# Altium project Net.PrjPcb
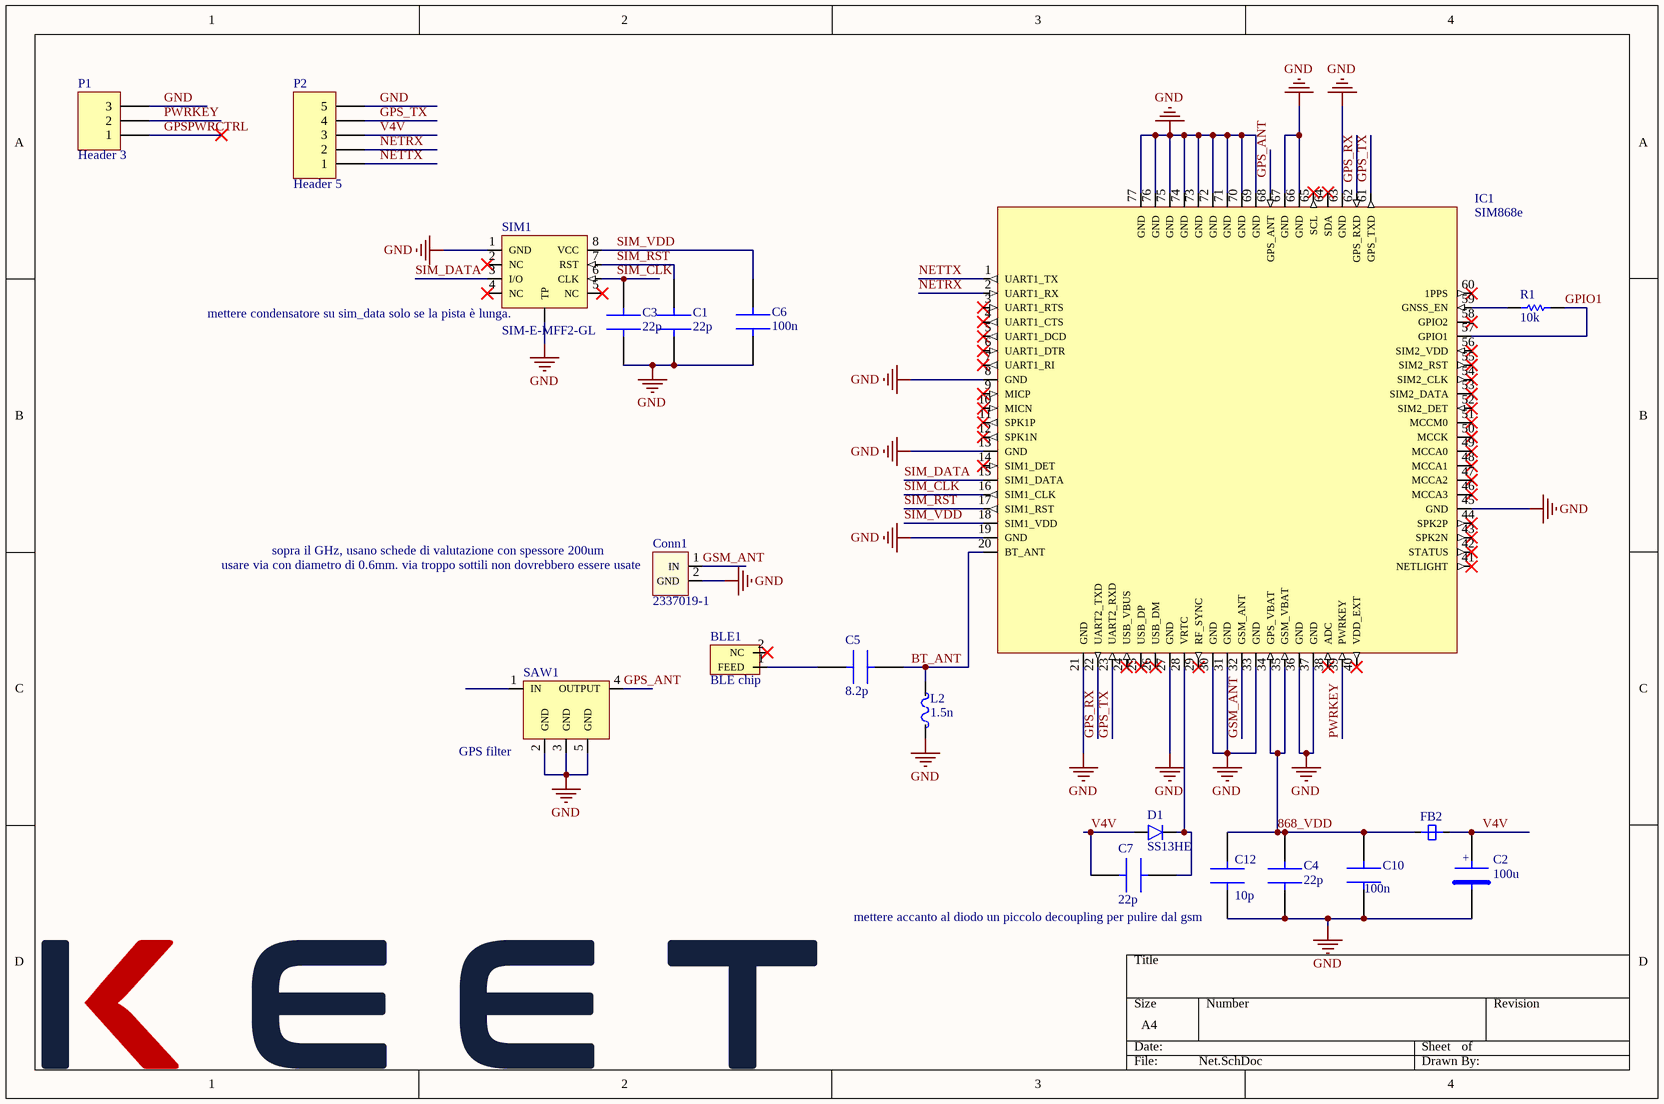
[diagram p0: Net.SchDoc]
1 sheet, 20 parts. Net scope: global (net labels, ports and power ports of the same name join across sheets).
Board file: Net.PcbDoc

## Sheet Net.SchDoc
size A4

### Parts
BLE1  BLE chip  [BLE antenna]
C1  22p  [CAPC1005X06N]
C2  100u  [CAPMP3528X21N]
C3  22p  [CAPC1005X06N]
C4  22p  [CAPC1005X06N]
C5  8.2p  [CAPC1005X06N]
C6  100n  [CAPC1005X06N]
C7  22p  [CAPC1005X06N]
C10  100n  [CAPC1005X06N]
C12  10p  [CAPC1005X06N]
Conn1  2337019-1  [IPEX_CONNECTOR_RF]
D1  SS13HE  [SODFL250X75-2N]
FB2  FBMH2012HM221-T  [INDC2012X14N]  (value not drawn)
IC1  SIM868e  [SIM868e]
L2  1.5n  [INDC1005X06N]
P1  Header 3  [HDR1X3]
P2  Header 5  [HDR1X5]
R1  10k  [RESC1005X04N]
SAW1  GPS filter  [SAW]
SIM1  SIM-E-MFF2-GL  [MFF2 SIM]

### Nets
GND: C1.1 C2.2 C3.1 C4.1 C6.2 C10.2 C12.1 Conn1.2(GND) IC1.8(GND) IC1.13(GND) IC1.19(GND) IC1.21(GND) IC1.27(GND) IC1.30(GND) IC1.31(GND) IC1.33(GND) IC1.36(GND) IC1.37(GND) IC1.45(GND) IC1.63(GND) IC1.66(GND) IC1.67(GND) IC1.69(GND) IC1.70(GND) IC1.71(GND) IC1.72(GND) IC1.73(GND) IC1.74(GND) IC1.75(GND) IC1.76(GND) IC1.77(GND) L2.1 P1.3 P2.5 SAW1.2(GND) SAW1.3(GND) SAW1.5(GND) SIM1.1(GND) SIM1.9(TP)
868_VDD: C4.2 C10.1 C12.2 FB2.1 IC1.34(GPS_VBAT) IC1.35(GSM_VBAT)
BT_ANT: C5.2 IC1.20(BT_ANT) L2.2
GPIO1: IC1.57(GPIO1) R1.2
GPS_ANT: IC1.68(GPS_ANT) SAW1.4(OUTPUT)
GPS_RX: IC1.22(UART2_TXD) IC1.62(GPS_RXD)
GPS_TX: IC1.23(UART2_RXD) IC1.61(GPS_TXD) P2.4
GPSPWRCTRL: P1.1
GSM_ANT: Conn1.1(IN) IC1.32(GSM_ANT)
NETRX: IC1.2(UART1_RX) P2.2
NETTX: IC1.1(UART1_TX) P2.1
PWRKEY: IC1.39(PWRKEY) P1.2
SIM_CLK: C3.2 IC1.16(SIM1_CLK) SIM1.6(CLK)
SIM_DATA: IC1.15(SIM1_DATA) SIM1.3(I/O)
SIM_RST: C1.2 IC1.17(SIM1_RST) SIM1.7(RST)
SIM_VDD: C6.1 IC1.18(SIM1_VDD) SIM1.8(VCC)
V4V: C2.1 C7.1 D1.1(A) FB2.2 P2.3
NetBLE1_1: BLE1.1(FEED) C5.1
NetC7_2: C7.2 D1.2(K) IC1.28(VRTC)
NetIC1_59: IC1.59(GNSS_EN) R1.1

Not connected (* = marked no-connect by the designer): BLE1 2(NC)*; IC1 3(UART1_RTS)* 4(UART1_CTS)* 5(UART1_DCD)* 6(UART1_DTR)* 7(UART1_RI)* 9(MICP)* 10(MICN)* 11(SPK1P)* 12(SPK1N)* 14(SIM1_DET)* 24(USB_VBUS)* 25(USB_DP)* 26(USB_DM)* 29(RF_SYNC)* 38(ADC)* 40(VDD_EXT)* 41(NETLIGHT)* 42(STATUS)* 43(SPK2N)* 44(SPK2P)* 46(MCCA3)* 47(MCCA2)* 48(MCCA1)* 49(MCCA0)* 50(MCCK)* 51(MCCM0)* 52(SIM2_DET)* 53(SIM2_DATA)* 54(SIM2_CLK)* 55(SIM2_RST)* 56(SIM2_VDD)* 58(GPIO2)* 60(1PPS)* 64(SDA)* 65(SCL)*; SAW1 1(IN); SIM1 2(NC)* 4(NC)* 5(NC)*

### Notes on the sheet
- (near SIM1) mettere condensatore su sim_data solo se la pista è lunga.
- (near Conn1) sopra il GHz, usano schede di valutazione con spessore 200um
- (near Conn1) usare via con diametro di 0.6mm. via troppo sottili non dovrebbero essere usate
- mettere accanto al diodo un piccolo decoupling per pulire dal gsm
- (in symbol TPSB107K006R0250) +

### Library data of the parts
BLE1 = 2450AT14A0100T: RF ANT 2.4GHZ CHIP SOLDER SMD; Manufacturer: Johanson; Number of Bands: 1; Return Loss: 9dB; Max Power Dissipation: 2W; Supplier 1: Digi-Key; Manufacturer Part Number: 2450AT14A0100T; RoHS: No; Stock 1: 5238; Pricing 1: 1=0,42000, 10=0,35600, 25=0,33240, 100=0,26600, 250=0,24700, 500=0,20900, 1000=0,16150 (USD); Mount: Surface Mount; Packaging: Tape and Reel; Termination: Solder; ComponentLink1URL: https://www.johansontechnology.com/datasheets/2450AT14A0100/2450AT14A0100.pdf?src-supplier=Digi-Key; ComponentLink1Description: https://www.johansontechnology.com/datasheets/2450AT14A0100/2450AT14A0100.pdf?src-supplier=Digi-Key; Supplier Part Number 1: 712-1636-1-ND
C1 C3 C4 C7 = 04025A220GAT2A: CAP CER 22PF 50V C0G/NP0 0402; Manufacturer: Kyocera AVX; Dielectric: C0G; Tolerance: 2%; Supplier 1: Digi-Key; Manufacturer Part Number: 04025A220GAT2A; RoHS: Yes; Category: Ceramic Capacitors; Stock 1: 14713; Pricing 1: 1=0,50000, 10=0,35200, 50=0,26600, 100=0,23170, 500=0,17160, 1000=0,14586, 2500=0,13728, 5000=0,12870 (USD); Mount: Surface Mount; Case/Package: 0402; Case Code (Metric): 1005; Case Code (Imperial): 0402; Min Operating Temperature: -55°C; Max Operating Temperature: 125°C; Packaging: Tape and Reel; Capacitance: 22pF; Package Quantity: 1; Voltage Rating (DC): 50V; Termination: SMD/SMT; Voltage Rating: 50V; Series: -; Construction: Flat; Length: 1mm; Width: 0.02inch; Height: 0.63mm; Depth: 0.5mm; Thickness: 0.022inch; Radiation Hardening: No; RoHS Compliant: Yes; Lead Free: Lead Free; ComponentLink1URL: https://datasheet.ciiva.com/7614/ccog-7614677.pdf?src-supplier=Digi-Key; ComponentLink1Description: https://datasheet.ciiva.com/7614/ccog-7614677.pdf?src-supplier=Digi-Key; ComponentLink2URL: https://datasheet.ciiva.com/17490/ccog-17490486.pdf?src-supplier=Avnet+Europe; ComponentLink2Description: https://datasheet.ciiva.com/17490/ccog-17490486.pdf?src-supplier=Avnet+Europe; ComponentLink3URL: https://datasheet.ciiva.com/5413/ccog-243403-5413992.pdf?src-supplier=Mouser; ComponentLink3Description: https://datasheet.ciiva.com/5413/ccog-243403-5413992.pdf?src-supplier=Mouser; ComponentLink4URL: https://datasheet.ciiva.com/210/ccog-210553.pdf?src-supplier=Digi-Key; ComponentLink4Description: https://datasheet.ciiva.com/210/ccog-210553.pdf?src-supplier=Digi-Key; ComponentLink5URL: https://datasheet.ciiva.com/11530/ccog-11530027.pdf?src-supplier=Avnet; ComponentLink5Description: https://datasheet.ciiva.com/11530/ccog-11530027.pdf?src-supplier=Avnet; ComponentLink6URL: https://datasheet.ciiva.com/14886/ccog-14886974.pdf?src-supplier=Digi-Key; ComponentLink6Description: https://datasheet.ciiva.com/14886/ccog-14886974.pdf?src-supplier=Digi-Key; Supplier Part Number 1: 478-7874-1-ND
C2 = TPSB107K006R0250: Capacitor; Tantalum; Cap 100 uF; Tol 10%; Vol-Rtg 6.3 VDC; SMT; 3528; ESR 250 mOhms; CT; Manufacturer: Kyocera AVX; Capacitance: 100uF; ESR (Equivalent Series Resistance): 250mR; Voltage Rating: 6.3V; Leakage Current: 6.3uA; Polarity: Polar; Supplier 1: Digi-Key; Manufacturer Part Number: TPSB107K006R0250; RoHS: Yes; Category: Tantalum Capacitors; Pricing 1: 1=0,51000, 10=0,36100, 50=0,27280, 100=0,23760, 500=0,17600, 1000=0,14960 (USD); Mount: Surface Mount,PCB; Case/Package: 1210; Number of Pins: 2; Case Code (Metric): 3528; Case Code (Imperial): 1210; Weight: 0.000564oz; Dielectric Material: Tantalum; Min Operating Temperature: -55°C; Max Operating Temperature: 125°C; Tolerance: 10%; Packaging: Tape and Reel; Package Quantity: 1; Voltage Rating (DC): 6.3V; Termination: SMD/SMT; Voltage: 6.3V; Dissipation Factor: 10%; Features: General Purpose; Series: TPS; Construction: Flat; Length: 3.5mm; Width: 0.11inch; Height: 1.9mm; Depth: 2.8mm; Height - Seated (Max): 0.083inch; Lead Pitch: 1.4mm; Radiation Hardening: No; REACH SVHC: No SVHC; Lead Free: Lead Free; RoHS Compliant: Yes; ComponentLink1URL: https://datasheet.ciiva.com/264/tps-264099.pdf?src-supplier=Digi-Key; ComponentLink1Description: https://datasheet.ciiva.com/264/tps-264099.pdf?src-supplier=Digi-Key; ComponentLink2URL: https://datasheet.ciiva.com/16501/tps-16501596.pdf?src-supplier=Future+Electronics; ComponentLink2Description: https://datasheet.ciiva.com/16501/tps-16501596.pdf?src-supplier=Future+Electronics; ComponentLink3URL: https://datasheet.ciiva.com/14603/70001047-14603743.pdf?src-supplier=Allied+Electronics; ComponentLink3Description: https://datasheet.ciiva.com/14603/70001047-14603743.pdf?src-supplier=Allied+Electronics; ComponentLink4URL: https://datasheet.ciiva.com/264/tps-264097.pdf?src-supplier=Digi-Key; ComponentLink4Description: https://datasheet.ciiva.com/264/tps-264097.pdf?src-supplier=Digi-Key; ComponentLink5URL: https://datasheet.ciiva.com/264/tps-264098.pdf?src-supplier=Digi-Key; ComponentLink5Description: https://datasheet.ciiva.com/264/tps-264098.pdf?src-supplier=Digi-Key; ComponentLink6URL: https://datasheet.ciiva.com/3004/tps-3004597.pdf?src-supplier=Avnet; ComponentLink6Description: https://datasheet.ciiva.com/3004/tps-3004597.pdf?src-supplier=Avnet; ComponentLink7URL: https://datasheet.ciiva.com/7720/1680477-7720696.pdf?src-supplier=Element14; ComponentLink7Description: https://datasheet.ciiva.com/7720/1680477-7720696.pdf?src-supplier=Element14; ComponentLink8URL: https://datasheet.ciiva.com/22703/1441576-22703321.pdf?src-supplier=Element14; ComponentLink8Description: https://datasheet.ciiva.com/22703/1441576-22703321.pdf?src-supplier=Element14; ComponentLink9URL: https://datasheet.ciiva.com/12911/tps-23028-12911388.pdf?src-supplier=Mouser; ComponentLink9Description: https://datasheet.ciiva.com/12911/tps-23028-12911388.pdf?src-supplier=Mouser; ComponentLink10URL: https://datasheet.ciiva.com/17339/tps-17339804.pdf?src-supplier=Avnet+Europe; ComponentLink10Description: https://datasheet.ciiva.com/17339/tps-17339804.pdf?src-supplier=Avnet+Europe; Supplier Part Number 1: 478-3080-1-ND
C5 = GJM1555C1H8R2CB01D: 0402 8.2 pF 50V ±0.25 pF Tolerance C0G SMT Multilayer Ceramic Capacitor; Manufacturer: Murata; Capacitance: 8.2pF; Temperature Coefficient: 30ppm/°C; Supplier 1: Digi-Key; Manufacturer Part Number: GJM1555C1H8R2CB01D; RoHS: Yes; Category: Ceramic Capacitors; Stock 1: 78290; Pricing 1: 1=0,12000, 10=0,08500, 50=0,04620, 100=0,03770, 500=0,02696, 1000=0,02118, 2500=0,01925, 5000=0,01771 (USD); Mount: Surface Mount; Case/Package: 0402; Number of Pins: 2; Case Code (Metric): 1005; Case Code (Imperial): 0402; Min Operating Temperature: -55°C; Max Operating Temperature: 125°C; Dielectric: C0G; Voltage Rating: 50V; Package Quantity: 1; Packaging: Tape and Reel; Voltage Rating (DC): 50V; Termination: SMD/SMT; Voltage: 50V; Series: GJM; Construction: Flat; Length: 1mm; Width: 0.5mm; Height: 0.5mm; Thickness: 0.022inch; Depth: 0.5mm; Lead Pitch: 0.3mm; Radiation Hardening: No; REACH SVHC: No SVHC; Lead Free: Lead Free; RoHS Compliant: Yes; ComponentLink1URL: https://datasheet.ciiva.com/8030/1700180-8030128.pdf?src-supplier=Element14; ComponentLink1Description: https://datasheet.ciiva.com/8030/1700180-8030128.pdf?src-supplier=Element14; ComponentLink2URL: https://datasheet.ciiva.com/17453/product-17453509.pdf?src-supplier=Avnet+Europe; ComponentLink2Description: https://datasheet.ciiva.com/17453/product-17453509.pdf?src-supplier=Avnet+Europe; ComponentLink3URL: https://datasheet.ciiva.com/11610/product-11610070.pdf?src-supplier=Avnet; ComponentLink3Description: https://datasheet.ciiva.com/11610/product-11610070.pdf?src-supplier=Avnet; ComponentLink4URL: https://datasheet.ciiva.com/159/partnumbering-e-01-159560.pdf?src-supplier=Digi-Key; ComponentLink4Description: https://datasheet.ciiva.com/159/partnumbering-e-01-159560.pdf?src-supplier=Digi-Key; ComponentLink5URL: https://datasheet.ciiva.com/159/partnumbering-e-01-159561.pdf?src-supplier=Digi-Key; ComponentLink5Description: https://datasheet.ciiva.com/159/partnumbering-e-01-159561.pdf?src-supplier=Digi-Key; ComponentLink6URL: https://datasheet.ciiva.com/11463/product-11463819.pdf?src-supplier=Avnet; ComponentLink6Description: https://datasheet.ciiva.com/11463/product-11463819.pdf?src-supplier=Avnet; Supplier Part Number 1: 490-3110-1-ND
C6 C10 = GRM155R71C104KA88D: CAP CER 0.1UF 16V X7R 0402; Manufacturer: Murata; Material: Ceramic; Capacitance: 100nF; Tolerance: 10%; Insulation Resistance: 10GR; Supplier 1: Mouser; Manufacturer Part Number: GRM155R71C104KA88D; RoHS: Yes; Category: Ceramic Capacitors; Stock 1: 8059685; Pricing 1: 1=0,10000, 10=0,01200, 50=0,01200, 100=0,01000, 1000=0,00600, 10000=0,00300 (USD); Mount: Surface Mount; Case/Package: 0402; Number of Pins: 2; Case Code (Metric): 1005; Case Code (Imperial): 0402; Dielectric Material: Ceramic; Min Operating Temperature: -55°C; Max Operating Temperature: 125°C; Dielectric: X7R; Voltage Rating: 16V; Packaging: Tape and Reel; Voltage Rating (DC): 16V; Package Quantity: 1; Termination: SMD/SMT; Voltage: 16V; Length: 1mm; Width: 0.5mm; Height: 0.5mm; Thickness: 0.022inch; Depth: 0.5mm; Radiation Hardening: No; REACH SVHC: No SVHC; Lead Free: Lead Free; RoHS Compliant: Yes; ComponentLink1URL: https://datasheet.ciiva.com/18102/getdatasheetpartid-85307-18102905.pdf?src-supplier=Verical; ComponentLink1Description: https://datasheet.ciiva.com/18102/getdatasheetpartid-85307-18102905.pdf?src-supplier=Verical; ComponentLink2URL: https://datasheet.ciiva.com/129/grm155r71c104ka88-01-129739.pdf?src-supplier=Digi-Key; ComponentLink2Description: https://datasheet.ciiva.com/129/grm155r71c104ka88-01-129739.pdf?src-supplier=Digi-Key; ComponentLink3URL: https://datasheet.ciiva.com/129/grm155r71c104ka88-01-129740.pdf?src-supplier=Digi-Key; ComponentLink3Description: https://datasheet.ciiva.com/129/grm155r71c104ka88-01-129740.pdf?src-supplier=Digi-Key; ComponentLink4URL: https://datasheet.ciiva.com/29199/454098-da-01-en-vs-kondensator-0402-29199799.pdf?src-supplier=Conrad; ComponentLink4Description: https://datasheet.ciiva.com/29199/454098-da-01-en-vs-kondensator-0402-29199799.pdf?src-supplier=Conrad; ComponentLink5URL: https://datasheet.ciiva.com/28534/4360-28534133.pdf?src-supplier=Element14; ComponentLink5Description: https://datasheet.ciiva.com/28534/4360-28534133.pdf?src-supplier=Element14; ComponentLink6URL: https://datasheet.ciiva.com/14103/grmseries-highdielectrictype-eng-14103750.pdf?src-supplier=Distrelec; ComponentLink6Description: https://datasheet.ciiva.com/14103/grmseries-highdielectrictype-eng-14103750.pdf?src-supplier=Distrelec; ComponentLink7URL: https://datasheet.ciiva.com/16199/product-16199000.pdf?src-supplier=Future+Electronics; ComponentLink7Description: https://datasheet.ciiva.com/16199/product-16199000.pdf?src-supplier=Future+Electronics; ComponentLink8URL: https://datasheet.ciiva.com/14116/grmseries-highdielectrictype-eng-14116878.pdf?src-supplier=Distrelec; ComponentLink8Description: https://datasheet.ciiva.com/14116/grmseries-highdielectrictype-eng-14116878.pdf?src-supplier=Distrelec; ComponentLink9URL: https://datasheet.ciiva.com/7937/4360-7937615.pdf?src-supplier=Element14; ComponentLink9Description: https://datasheet.ciiva.com/7937/4360-7937615.pdf?src-supplier=Element14; ComponentLink10URL: https://datasheet.ciiva.com/28534/4360-28534127.pdf?src-supplier=Element14; ComponentLink10Description: https://datasheet.ciiva.com/28534/4360-28534127.pdf?src-supplier=Element14; Supplier Part Number 1: 81-GRM155R71C104KA88
C12 = 04023J100FBSTR: Multilayer Ceramic Capacitors MLCC - SMD/SMT 25V 10pF ThnFlm 0402 1% Tol; Manufacturer: Kyocera AVX; Supplier 1: Mouser; Manufacturer Part Number: 04023J100FBSTR; RoHS: Yes; Category: Film Capacitors; Stock 1: 1287; Pricing 1: 1=0,98000, 10=0,74000, 50=0,74000, 100=0,52900, 1000=0,35300, 10000=0,26100 (USD); Case/Package: 0402; Case Code (Imperial): 0402; Case Code (Metric): 1005; Weight: 2.3E-05oz; Min Operating Temperature: -55°C; Max Operating Temperature: 125°C; Voltage Rating (DC): 25V; Tolerance: 1%; Packaging: Tape and Reel; Termination: SMD/SMT; Resistor Type: Thin Film; Capacitance: 10pF; Length: 1mm; Width: 0.5mm; Height: 0.4mm; ComponentLink1URL: http://www.mouser.com/ds/2/40/avx_accuf-p-542740.pdf?src-supplier=Mouser; ComponentLink1Description: http://www.mouser.com/ds/2/40/avx_accuf-p-542740.pdf?src-supplier=Mouser; Supplier Part Number 1: 581-04023J100FBSTR
Conn1 = 2337019-1: RF Connector; Coaxial Connectors MicroCoax receptacle UMCC Gen 1; Manufacturer: TE Connectivity; Supplier 1: Digi-Key; Manufacturer Part Number: 2337019-1; RoHS: Yes; Category: RF / Coaxial Connectors; Stock 1: 3490; Pricing 1: 1=0,19000, 10=0,18000, 25=0,15360, 50=0,13440, 100=0,12470, 250=0,11032, 500=0,10554, 1000=0,08635, 2500=0,07915 (USD); Supplier Part Number 1: A144746CT-ND
D1 = SS13HE: SS13HE Series 30 V 1 A Surface Mount Schottky Barrier Rectifier - SOD-323HE; Manufacturer: ON Semiconductor / Fairchild; Average Rectified Current: 1A; Max Reverse Voltage (DC): 30V; Element Configuration: Single; Reverse Recovery Time: 5.6ns; Max Forward Surge Current (Ifsm): 25A; Supplier 1: Digi-Key; Manufacturer Part Number: SS13HE; RoHS: No; Category: Rectifier Diodes; Stock 1: 102; Pricing 1: 1=0,50000, 10=0,34900, 100=0,17640, 500=0,14392, 1000=0,10678 (USD); Mount: Surface Mount; Case/Package: SMD/SMT; Weight: 0.006g; Packaging: Tape and Reel; Max Repetitive Reverse Voltage (Vrrm): 30V; RoHS Compliant: No; ComponentLink1URL: https://www.fairchildsemi.com/datasheets/SS/SS13HE.pdf?src-supplier=Digi-Key; ComponentLink1Description: https://www.fairchildsemi.com/datasheets/SS/SS13HE.pdf?src-supplier=Digi-Key; Supplier Part Number 1: SS13HECT-ND
FB2 = FBMH2012HM221-T: Ferrite Beads HI CUR CHIP BD 0805 220OHMS 25%; Manufacturer: Taiyo Yuden; DC Resistance (DCR): 60mR; Impedance: 220R; Max Current Rating: 2A; Number of Lines: 1; Test Frequency: 100MHz; Shielding: Unshielded; Supplier 1: Digi-Key; Manufacturer Part Number: FBMH2012HM221-T; RoHS: Yes; Category: Ferrite Beads and Chips; Stock 1: 15865; Pricing 1: 1=0,18000, 10=0,14800, 25=0,11560, 50=0,09560, 100=0,08250, 250=0,06600, 500=0,05940, 1000=0,04950 (USD); Mount: Surface Mount; Case/Package: 0805; Number of Pins: 2; Case Code (Metric): 2012; Case Code (Imperial): 0805; Material: Ferrite; Core Material: Ferrite; Min Operating Temperature: -40°C; Max Operating Temperature: 125°C; Packaging: Tape and Reel; Package Quantity: 1; Termination: SMD/SMT; Resistance: 60mR; Max DC Current: 2A; Series: FB; Tolerance: 25%; Frequency: 100MHz; Resistor Type: Ferrite Bead; Length: 2mm; Width: 0.049inch; Height: 0.041inch; Depth: 1.45mm; RoHS Compliant: Yes; Lead Free: Lead Free; REACH SVHC: No SVHC; Halogen Free: Halogen Free; ComponentLink1URL: https://datasheet.ciiva.com/25614/0900766b810b37be-25614417.pdf?src-supplier=RSComponents; ComponentLink1Description: https://datasheet.ciiva.com/25614/0900766b810b37be-25614417.pdf?src-supplier=RSComponents; ComponentLink2URL: https://datasheet.ciiva.com/6212/fbmh2012hm221-t-ss-6212838.pdf?src-supplier=Digi-Key; ComponentLink2Description: https://datasheet.ciiva.com/6212/fbmh2012hm221-t-ss-6212838.pdf?src-supplier=Digi-Key; ComponentLink3URL: https://datasheet.ciiva.com/7966/1734575-7966170.pdf?src-supplier=Element14; ComponentLink3Description: https://datasheet.ciiva.com/7966/1734575-7966170.pdf?src-supplier=Element14; ComponentLink4URL: https://datasheet.ciiva.com/6212/chipbeads01-e-6212839.pdf?src-supplier=Digi-Key; ComponentLink4Description: https://datasheet.ciiva.com/6212/chipbeads01-e-6212839.pdf?src-supplier=Digi-Key; ComponentLink5URL: https://datasheet.ciiva.com/6212/chipbeads01-e-6212841.pdf?src-supplier=Digi-Key; ComponentLink5Description: https://datasheet.ciiva.com/6212/chipbeads01-e-6212841.pdf?src-supplier=Digi-Key; Supplier Part Number 1: 587-1748-1-ND
IC1 = SIM868e: Sim 828e
L2 = LQG15HN1N5S02D: FIXED IND 1.5NH 1A 100 MOHM; Manufacturer: Murata; Core Material: Air; DC Resistance (DCR): 100mR; Max DC Current: 300mA; Shielding: Unshielded; Q Factor: 8; Self Resonant Frequency: 6GHz; Test Frequency: 100MHz; Inductor Type: MONOLITHIC; Supplier 1: Digi-Key; Manufacturer Part Number: LQG15HN1N5S02D; RoHS: Yes; Category: Fixed Inductors; Stock 1: 23404; Pricing 1: 1=0,10000, 10=0,05300, 25=0,04680, 50=0,03980, 100=0,03510, 250=0,03216, 500=0,02924, 1000=0,02457, 2500=0,02106 (USD); Mount: Surface Mount; Case/Package: 0402; Number of Pins: 2; Case Code (Metric): 1005; Case Code (Imperial): 0402; Min Operating Temperature: -55°C; Max Operating Temperature: 125°C; Inductance: 1.5nH; Package Quantity: 1; Packaging: Tape and Reel; Current Rating: 300mA; Termination: SMD/SMT; DC Current: 300mA; Series: LQG15HS; Length: 1mm; Width: 0.02inch; Height: 0.5mm; Height - Seated (Max): 0.022inch; Depth: 0.55mm; Radiation Hardening: No; REACH SVHC: No SVHC; Military Standard: Not; Lead Free: Lead Free; RoHS Compliant: Yes; ComponentLink1URL: https://datasheet.ciiva.com/11801/0900766b80f10808-11801406.pdf?src-supplier=RSComponents; ComponentLink1Description: https://datasheet.ciiva.com/11801/0900766b80f10808-11801406.pdf?src-supplier=RSComponents; ComponentLink2URL: https://datasheet.ciiva.com/17279/l0075s0083lqg15hn-17279189.pdf?src-supplier=Avnet+Europe; ComponentLink2Description: https://datasheet.ciiva.com/17279/l0075s0083lqg15hn-17279189.pdf?src-supplier=Avnet+Europe; ComponentLink3URL: https://datasheet.ciiva.com/4977/o05e-4977527.pdf?src-supplier=Mouser; ComponentLink3Description: https://datasheet.ciiva.com/4977/o05e-4977527.pdf?src-supplier=Mouser; ComponentLink4URL: https://datasheet.ciiva.com/8510/l0075s0083lqg15hn-8510903.pdf?src-supplier=Avnet; ComponentLink4Description: https://datasheet.ciiva.com/8510/l0075s0083lqg15hn-8510903.pdf?src-supplier=Avnet; ComponentLink5URL: https://datasheet.ciiva.com/8002/66026-8002508.pdf?src-supplier=Element14; ComponentLink5Description: https://datasheet.ciiva.com/8002/66026-8002508.pdf?src-supplier=Element14; ComponentLink6URL: https://datasheet.ciiva.com/8002/66026-8002509.pdf?src-supplier=Element14; ComponentLink6Description: https://datasheet.ciiva.com/8002/66026-8002509.pdf?src-supplier=Element14; ComponentLink7URL: https://datasheet.ciiva.com/1063/l0075s0083lqg15hn-1063838.pdf?src-supplier=Digi-Key; ComponentLink7Description: https://datasheet.ciiva.com/1063/l0075s0083lqg15hn-1063838.pdf?src-supplier=Digi-Key; ComponentLink8URL: https://datasheet.ciiva.com/16444/l0075s0083lqg15hn-16444367.pdf?src-supplier=Future+Electronics; ComponentLink8Description: https://datasheet.ciiva.com/16444/l0075s0083lqg15hn-16444367.pdf?src-supplier=Future+Electronics; Supplier Part Number 1: 490-1075-1-ND
P1 = Header 3: Header, 3-Pin; System: Connector; LatestRevisionDate: 17-Jul-2002; LatestRevisionNote: Re-released for DXP Platform.; Publisher: Altium Limited
P2 = Header 5: Header, 5-Pin; System: Connector; LatestRevisionDate: 17-Jul-2002; LatestRevisionNote: Re-released for DXP Platform.; Publisher: Altium Limited
R1 = ERJ-U02F1002X: RES, THICK FILM, 10K, 1%, 0.1W, 0402, REEL; Product Range:AEC-Q200 ERJ Series; Resistance:10kohm; Power Rating:100mW; Resistance Tolerance: 1%; Voltage Rating:50V; Resistor Case Style:0402 [1005 Metric]; Packaging:Tape & Reel; MSL:-;RoHS Compliant: Yes; Manufacturer: Panasonic; Resistance: 10kR; Power Rating: 100mW; Temperature Coefficient: 200ppm/°C; Voltage Rating: 50V; Current Rating: 1A; Supplier 1: Mouser; Manufacturer Part Number: ERJ-U02F1002X; RoHS: Yes; Category: Chip SMD Resistors; Stock 1: 30000; Pricing 1: 1=0,10000, 10=0,05100, 50=0,05100, 100=0,02900, 1000=0,01600, 10000=0,01200 (USD); Mount: Surface Mount; Case/Package: 0402; Case Code (Imperial): 0402; Case Code (Metric): 1005; Weight: 2.8E-05oz; Min Operating Temperature: -55°C; Max Operating Temperature: 155°C; Packaging: Tape and Reel; Tolerance: 1%; Resistor Type: Thick Film; Termination: SMD/SMT; Package Quantity: 10000; Voltage Rating (DC): 50V; Length: 1mm; Width: 0.5mm; Height: 0.35mm; Radiation Hardening: No; RoHS Compliant: Yes; REACH SVHC: Unknown; ComponentLink1URL: https://datasheet.ciiva.com/29928/aoa0000ce5-29928150.pdf?src-supplier=Avnet; ComponentLink1Description: https://datasheet.ciiva.com/29928/aoa0000ce5-29928150.pdf?src-supplier=Avnet; ComponentLink2URL: https://datasheet.ciiva.com/28514/1783557-28514361.pdf?src-supplier=Element14; ComponentLink2Description: https://datasheet.ciiva.com/28514/1783557-28514361.pdf?src-supplier=Element14; ComponentLink3URL: https://datasheet.ciiva.com/28514/1783557-28514367.pdf?src-supplier=Element14; ComponentLink3Description: https://datasheet.ciiva.com/28514/1783557-28514367.pdf?src-supplier=Element14; Supplier Part Number 1: 667-ERJ-U02F1002X
SAW1 = SF14-1582M5UUD2: Signal Conditioning SAW FILTER 1582MHz; Manufacturer: Kyocera AVX; Frequency: 1.582GHz; Impedance: 50R; Insertion Loss: 1.2dB; Supplier 1: Mouser; Manufacturer Part Number: SF14-1582M5UUD2; RoHS: Yes; Category: EMI / RFI Components; Stock 1: 11334; Pricing 1: 1=0,62000, 10=0,58500, 50=0,46600, 100=0,38000, 1000=0,30700, 10000=0,26100 (USD); Mount: Surface Mount; Number of Pins: 5; Min Operating Temperature: -40°C; Max Operating Temperature: 85°C; Termination: SMD/SMT; Packaging: Tape and Reel; Package Quantity: 3000; Load Impedance: 50R; Length: 1.4mm; RoHS Compliant: Yes; ComponentLink1URL: http://www.mouser.com/ds/2/40/AVX_140127%20Connectivity-315907.pdf?src-supplier=Mouser; ComponentLink1Description: http://www.mouser.com/ds/2/40/AVX_140127%20Connectivity-315907.pdf?src-supplier=Mouser; ComponentLink2URL: http://global.kyocera.com/prdct/electro/pdf/saw/sf14_cdma_e.pdf?src-supplier=Avnet+Asia; ComponentLink2Description: http://global.kyocera.com/prdct/electro/pdf/saw/sf14_cdma_e.pdf?src-supplier=Avnet+Asia; ComponentLink3URL: http://global.kyocera.com/prdct/function/products/saw-device/pdf/sf14_gnss_e.pdf?src-supplier=Digi-Key; ComponentLink3Description: http://global.kyocera.com/prdct/function/products/saw-device/pdf/sf14_gnss_e.pdf?src-supplier=Digi-Key; Supplier Part Number 1: 581-SF14-1582M5UUD2
SIM1 = SIM-E-MFF2-GL: Manufacturer: Hologram; Supplier 1: Digi-Key; Manufacturer Part Number: SIM-E-MFF2-GL; RoHS: No; Stock 1: 2884; Pricing 1: 1=5,43000, 10=4,87900, 25=4,61240, 100=3,99750, 250=3,79248, 500=3,40300 (USD); Supplier Part Number 1: 1887-SIM-E-MFF2-GLCT-ND